# EAGLE design IR Sensor (EAGLE 9.6.2)
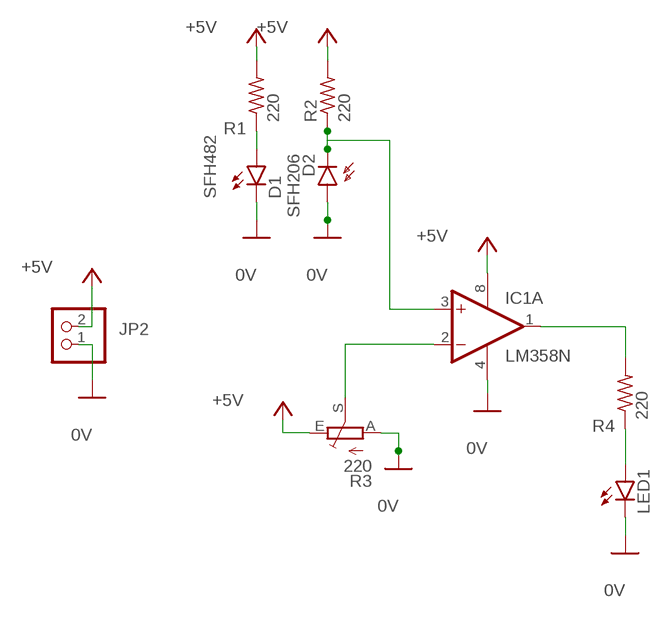
[diagram p0: schematic, sheet 1]

## Parts
D1  SFH482  [SFH482]
D2  SFH206  [SFH206]
IC1  LM358N  [DIL08]
JP2  PINHD-1X2  [1X02]
LED1  LED5MM  [LED5MM]
R1  220  R-US_0207/10  [0207/10]
R2  220  R-US_0207/10  [0207/10]
R3  220  TRIM_EU-CA6V  [CA6V]
R4  220  R-US_0207/10  [0207/10]

## Nets
0V: D1.K(C) D2.A IC1.4(P:V-) JP2.1 LED1.K(C) R3.A
+5V: IC1.8(P:V+) JP2.2 R1.2 R2.2 R3.E
N$1: IC1.1(A:OUT) R4.2
N$2: LED1.A R4.1
N$4: D1.A R1.1
N$5: D2.K(C) IC1.3(A:+IN) R2.1
N$6: IC1.2(A:-IN) R3.S
Unconnected: IC1.5(B:+IN) IC1.6(B:-IN) IC1.7(B:OUT)

## Library data of the parts
D1 = led:SFH482: IR LED infrared emitting diode, Infineon
D2 = opto-trans-siemens:SFH206: PHOTO DIODE; MPN: SFH206K; OC_FARNELL: 1212741; OC_NEWARK: 01M8807
IC1 = linear:LM358: OP AMP also LM158; LM258; LM2904 Source: http://cache.national.com/ds/LM/LM158.pdf
JP2 = pinhead:PINHD-1X2: PIN HEADER
LED1 = led:LED: LED OSRAM: - CHIPLED LG R971, LG N971, LY N971, LG Q971, LY Q971, LO R971, LY R971 LH N974, LH R974 LS Q976, LO Q976, LY Q976 LO Q996 - Hyper CHIPLED LW Q18S LB Q993, LB Q99A, LB R99A - SideLED LS A670, LO A670, LY A670, LG A670, LP A670 LB A673, LV A673, LT A673, LW A673 LH A674 LY A675 LS A676, LA A676, LO A676, LY A676, LW A676 LS A679, LY A679, LG A679 - Hyper Micro SIDELED® LS Y876, LA Y876, LO Y876, LY Y876 LT Y87S - SmartLED LW L88C, LW L88S LB L89C, LB L89S, LG L890 LS L89K, LO L89K, LY L89K LS L896, LA L896, LO L896, LY L896 - TOPLED LS T670, LO T670, LY T670, LG T670, LP T670 LSG T670, LSP T670, LSY T670, LOP T670, LYG T670 LG T671, LOG T671, LSG T671 LB T673, LV T673, LT T673, LW T673 LH T674 LS T676, LA T676, LO T676, LY T676, LB T676, LH T676, LSB T676, LW T676 LB T67C, LV T67C, LT T67C, LS T67K, LO T67K, LY T67K, LW E67C LS E67B, LA E67B, LO E67B, LY E67B, LB E67C, LV E67C, LT E67C LW T67C LS T679, LY T679, LG T679 LS T770, LO T770, LY T770, LG T770, LP T770 LB T773, LV T773, LT T773, LW T773 LH T774 LS E675, LA E675, LY E675, LS T675 LS T776, LA T776, LO T776, LY T776, LB T776 LHGB T686 LT T68C, LB T68C - Hyper Mini TOPLED® LB M676 - Mini TOPLED Santana® LG M470 LS M47K, LO M47K, LY M47K Source: http://www.osram.convergy.de LUXEON: - LUMILED® LXK2-PW12-R00, LXK2-PW12-S00, LXK2-PW14-U00, LXK2-PW14-V00 LXK2-PM12-R00, LXK2-PM12-S00, LXK2-PM14-U00 LXK2-PE12-Q00, LXK2-PE12-R00, LXK2-PE12-S00, LXK2-PE14-T00, LXK2-PE14-U00 LXK2-PB12-K00, LXK2-PB12-L00, LXK2-PB12-M00, LXK2-PB14-N00, LXK2-PB14-P00, LXK2-PB14-Q00 LXK2-PR12-L00, LXK2-PR12-M00, LXK2-PR14-Q00, LXK2-PR14-R00 LXK2-PD12-Q00, LXK2-PD12-R00, LXK2-PD12-S00 LXK2-PH12-R00, LXK2-PH12-S00 LXK2-PL12-P00, LXK2-PL12-Q00, LXK2-PL12-R00 Source: www.luxeon.com KINGBRIGHT: KA-3528ASYC Source: www.kingbright.com
R1 R2 R4 = rcl:R-US_: RESISTOR, American symbol; SPICEPREFIX: R
R3 = pot:TRIM_EU-: POTENTIOMETER

## Board
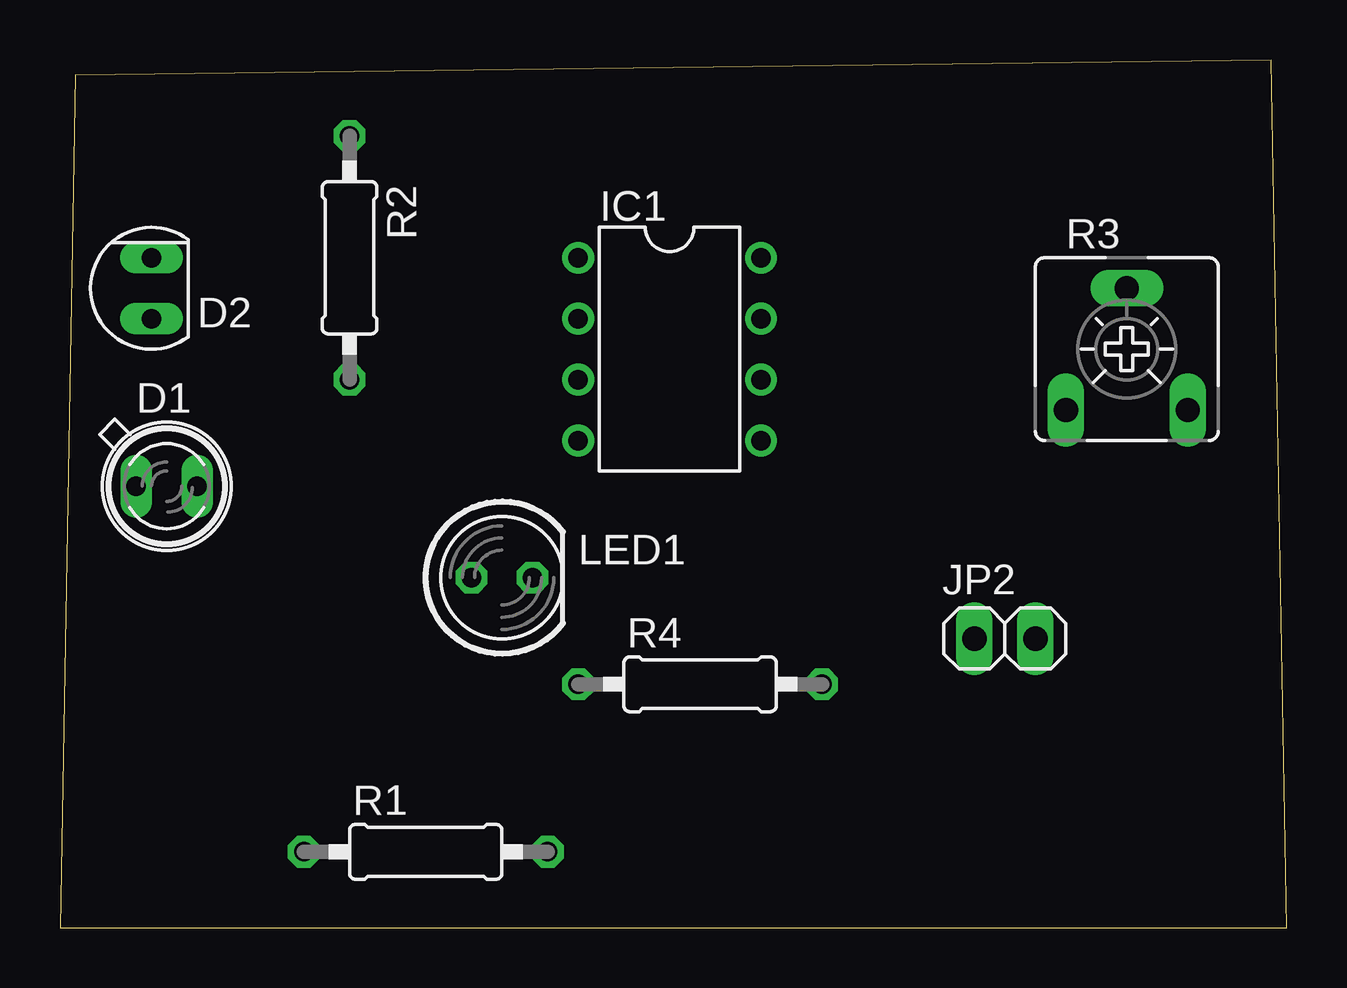
[diagram p1: board, top side]
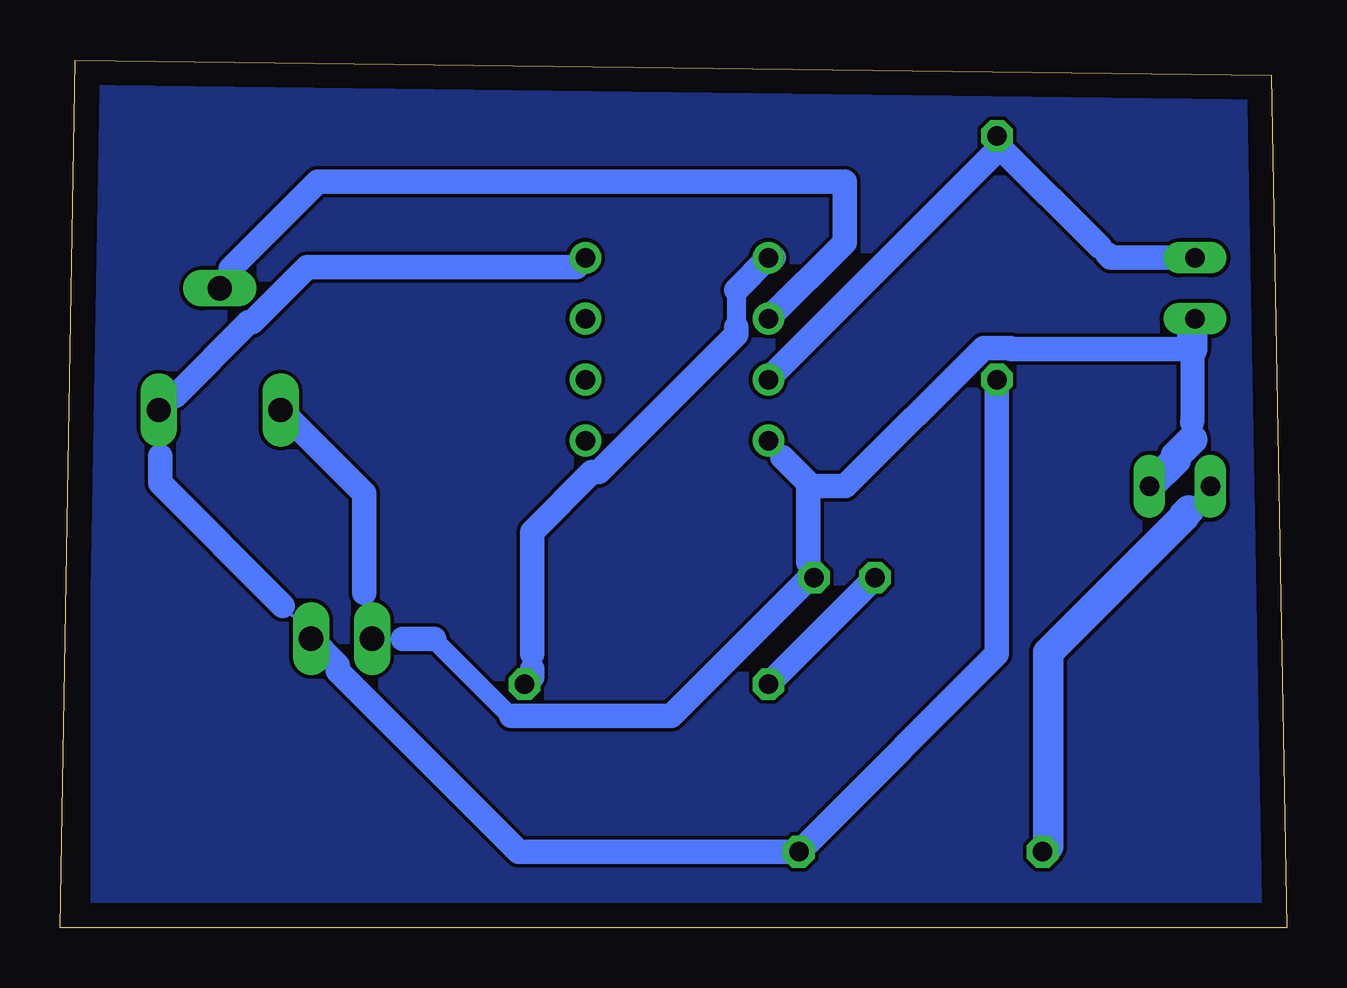
[diagram p2: board, bottom side, seen from below]

Size 51.11 x 36.19 mm. Coordinates in mm from the lower left corner, seen from the top.
Outline: 0,0 51.11,0 50.47,36.19 0.63,35.55 0,0
Copper layers (1*16): Top 0.035mm / dielectric 1.5mm / Bottom 0.035mm
Design rules "default": minimum track width 6mil, minimum drill 0.35mm, track to track 6mil, track to pad 6mil, pad to pad 6mil, via to via 6mil, smd to smd 6mil, copper to edge 40mil, drill to drill 6mil, minimum pad ring 10mil, minimum via ring 8mil, stop-mask expansion 4mil, vias tented up to drill 0mil, thermal gap 10mil

### Footprints (pad centres in the part's own frame; a part is rotated, then mirrored left to right if it is on the bottom)
SFH482 = drill 0.813 long: A -1.27,0; K 1.27,0
SFH206 = drill 0.813 long: A 0,-1.27; K 0,1.27
DIL08 = drill 0.813 pad 1.27: 1 -3.81,-3.81; 2 -1.27,-3.81; 3 1.27,-3.81; 4 3.81,-3.81; 5 3.81,3.81; 6 1.27,3.81; 7 -1.27,3.81; 8 -3.81,3.81
1X02 = drill 1.016 long: 1 -1.27,0; 2 1.27,0
LED5MM = drill 0.813 octagon: A -1.27,0; K 1.27,0
0207/10 = drill 0.813 octagon: 1 -5.08,0; 2 5.08,0
CA6V = drill 1.016 long: A -2.54,-2.54; E 2.54,-2.54; S 0,2.54

### Placement (x,y rotation side)
D1  4.45,18.41 0 top
D2  3.81,26.67 0 top
IC1  25.4,24.13 270 top
JP2  39.37,12.07 0 top
LED1  18.41,14.61 0 top
R1  15.24,3.18 0 top
R2  12.06,27.94 270 top
R3  44.45,24.13 0 top
R4  26.67,10.16 0 top

### Tracks (layer width: path | path; a pad name or v marks a point on that pad's centre or on a via)
0V
  Bottom 0.152: 38.44,13.97 38.44,12.55 JP2.1 37.94,12.05 36.83,12.05 | 19.94,15.24 19.94,15.05 LED1.K | 21.02,19.62 21.44,20.05 IC1.4 | 3.94,24.13 3.94,24.05 12.44,24.05 17.94,18.55 19.94,18.55 | 3.94,24.77 3.94,25.05 D2.A
  Bottom 0.6: 3.94,21.08 3.81,20.95 3.81,20.49 3.94,20.36 | 32.3,8.84 32.35,8.84
  Bottom 0.8: 32.35,8.84 35.56,12.05
  Bottom 1: 3.94,24.13 3.94,21.08
  Bottom 1.016: 19.94,18.41 18.38,18.41 12.61,24.18 11.52,24.18 11.47,24.13 3.94,24.13 | 19.94,15.24 19.94,18.41 | LED1.K 19.88,14.61 25.64,8.84 32.3,8.84 | 35.5,12.05 35.56,12.05 36.83,12.05 | R3.A 38.44,18.12 38.44,13.97 | 19.94,18.41 19.94,18.55 21.02,19.62
  Bottom 1.27: D1.K 4.62,19.51 4.62,19.68 3.94,20.36 | 3.94,24.77 3.94,24.13
+5V
  Bottom 0.152: 40.64,27.55 29.44,27.55 IC1.8 | 46.3,22.18 46.94,21.55 | 19.94,3.55 R1.2 | 46.94,21.55 46.94,19.69 | 41.82,13.43 40.94,12.55 JP2.2 | 46.94,21.55 R3.E
  Bottom 1.016: IC1.8 29.61,27.55 40.64,27.55 40.8,27.55 43.1,25.25 43.23,25.25 46.3,22.18 | 46.94,19.69 46.94,18.55 41.82,13.43 | JP2.2 39.52,10.95 39.52,10.71 31.98,3.18 R1.2 | R2.2 12.06,11.41 19.94,3.55
N$1
  Bottom 0.152: 31.44,10.8 31.44,11.43
  Bottom 0.8: 22.94,26.59 22.94,25.05
  Bottom 1.016: 21.37,27.94 IC1.1 22.94,26.59 | 22.94,25.05 22.94,24.73 28.66,19 28.95,19 31.44,16.51 31.44,11.43 | R4.2 31.44,10.48 31.44,10.8
N$2
  Bottom 1.016: LED1.A R4.1
N$3
  pour Bottom: 1.27,34.93 49.53,34.93 49.53,0.64 0.63,0.64 0.63,34.93
N$4
  Bottom 0.152: 4.07,17.41 3.44,18.05 D1.A
  Bottom 1.27: R1.1 9.94,3.4 9.94,11.49 4.27,17.16 4.27,17.21 4.07,17.41
N$5
  Bottom 0.152: 7.47,28.09 7.79,28.4 | 11.92,32.53 11.94,32.55 | 11.94,32.55 21.44,23.05 IC1.3 | 11.94,32.55 R2.1
  Bottom 1.016: D2.K 7.33,27.94 7.47,28.09 | 7.79,28.4 11.92,32.53 11.95,32.53 21.44,23.05
N$6
  Bottom 0.152: 44,27.48 44.44,27.05 R3.S
  Bottom 1.016: 21.44,25.55 IC1.2 18.41,28.58 18.41,31.12 40.37,31.12 44,27.48